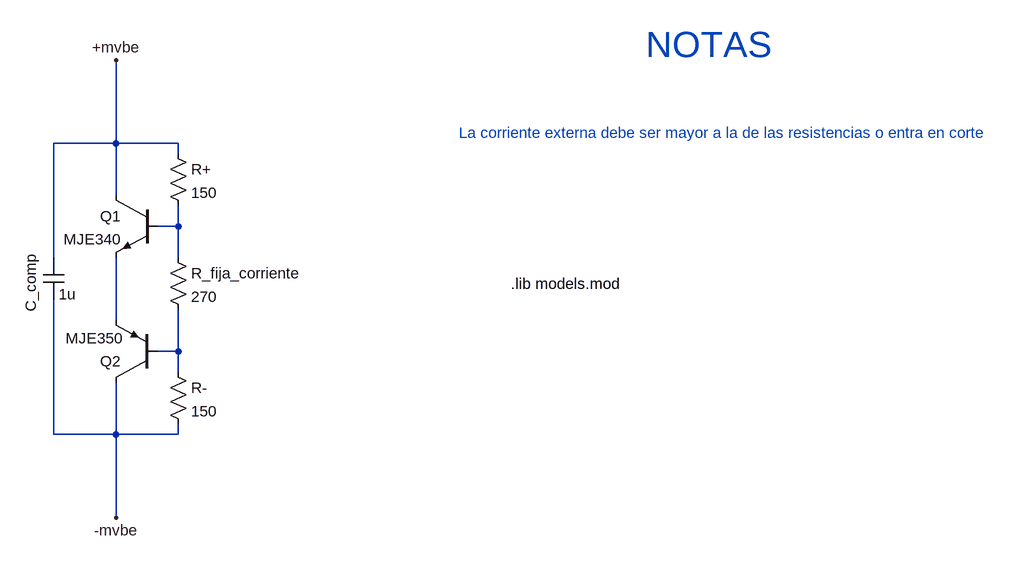
[diagram p0: schematic ss-mult-vbe.asc]
ss-mult-vbe.asc, the LTspice schematic file:
Version 4
SHEET 1 1364 680
WIRE -144 -256 -144 -384
WIRE -144 -256 -240 -256
WIRE -48 -256 -144 -256
WIRE -48 -240 -48 -256
WIRE -144 -176 -144 -256
WIRE -48 -128 -48 -160
WIRE -48 -128 -80 -128
WIRE -240 -80 -240 -256
WIRE -48 -80 -48 -128
WIRE -144 -32 -144 -80
WIRE -144 16 -144 -32
WIRE -48 64 -48 0
WIRE -48 64 -80 64
WIRE -48 96 -48 64
WIRE -240 192 -240 -16
WIRE -144 192 -144 112
WIRE -144 192 -240 192
WIRE -48 192 -48 176
WIRE -48 192 -144 192
WIRE -144 208 -144 192
WIRE -144 320 -144 208
FLAG -144 -384 +mvbe
FLAG -144 320 -mvbe
DATAFLAG -144 -256 "round($*100)/100"
DATAFLAG -144 208 "round($*100)/100"
DATAFLAG -48 64 "round($*1k)/1k"
DATAFLAG -48 -128 "round($*1k)/1k"
DATAFLAG -144 -32 "round($*1k)/1k"
SYMBOL npn -80 -176 M0
SYMATTR InstName Q1
SYMATTR Value MJE340
SYMBOL pnp -80 112 R180
WINDOW 0 56 33 Left 2
WINDOW 3 53 68 Left 2
SYMATTR InstName Q2
SYMATTR Value MJE350
SYMBOL res -64 -96 R0
SYMATTR InstName R_fija_corriente
SYMATTR Value 270
SYMBOL res -64 80 R0
SYMATTR InstName R-
SYMATTR Value 150
SYMBOL cap -256 -80 R0
WINDOW 0 -19 83 VLeft 2
SYMATTR InstName C_comp
SYMATTR Value 1u
SYMBOL res -64 -256 R0
SYMATTR InstName R+
SYMATTR Value 150
TEXT 384 -272 Left 2 ;La corriente externa debe ser mayor a la de las resistencias o entra en corte
TEXT 672 -408 Left 5 ;NOTAS
TEXT 464 -40 Left 2 !.lib models.mod

The netlist it stands for:
* ss-mult-vbe.asc
Q1 +mvbe N001 N002 0 MJE340
Q2 -mvbe N003 N002 0 MJE350
R_fija_corriente N001 N003 270
R- N003 -mvbe 150
C_comp +mvbe -mvbe 1u
R+ +mvbe N001 150
.model NPN NPN
.model PNP PNP
.lib standard.bjt
* La corriente externa debe ser mayor a la de las resistencias o entra en corte
* NOTAS
.lib models.mod
.backanno
.end